# Altium project PCB_CLOCK_STM.PrjPcb
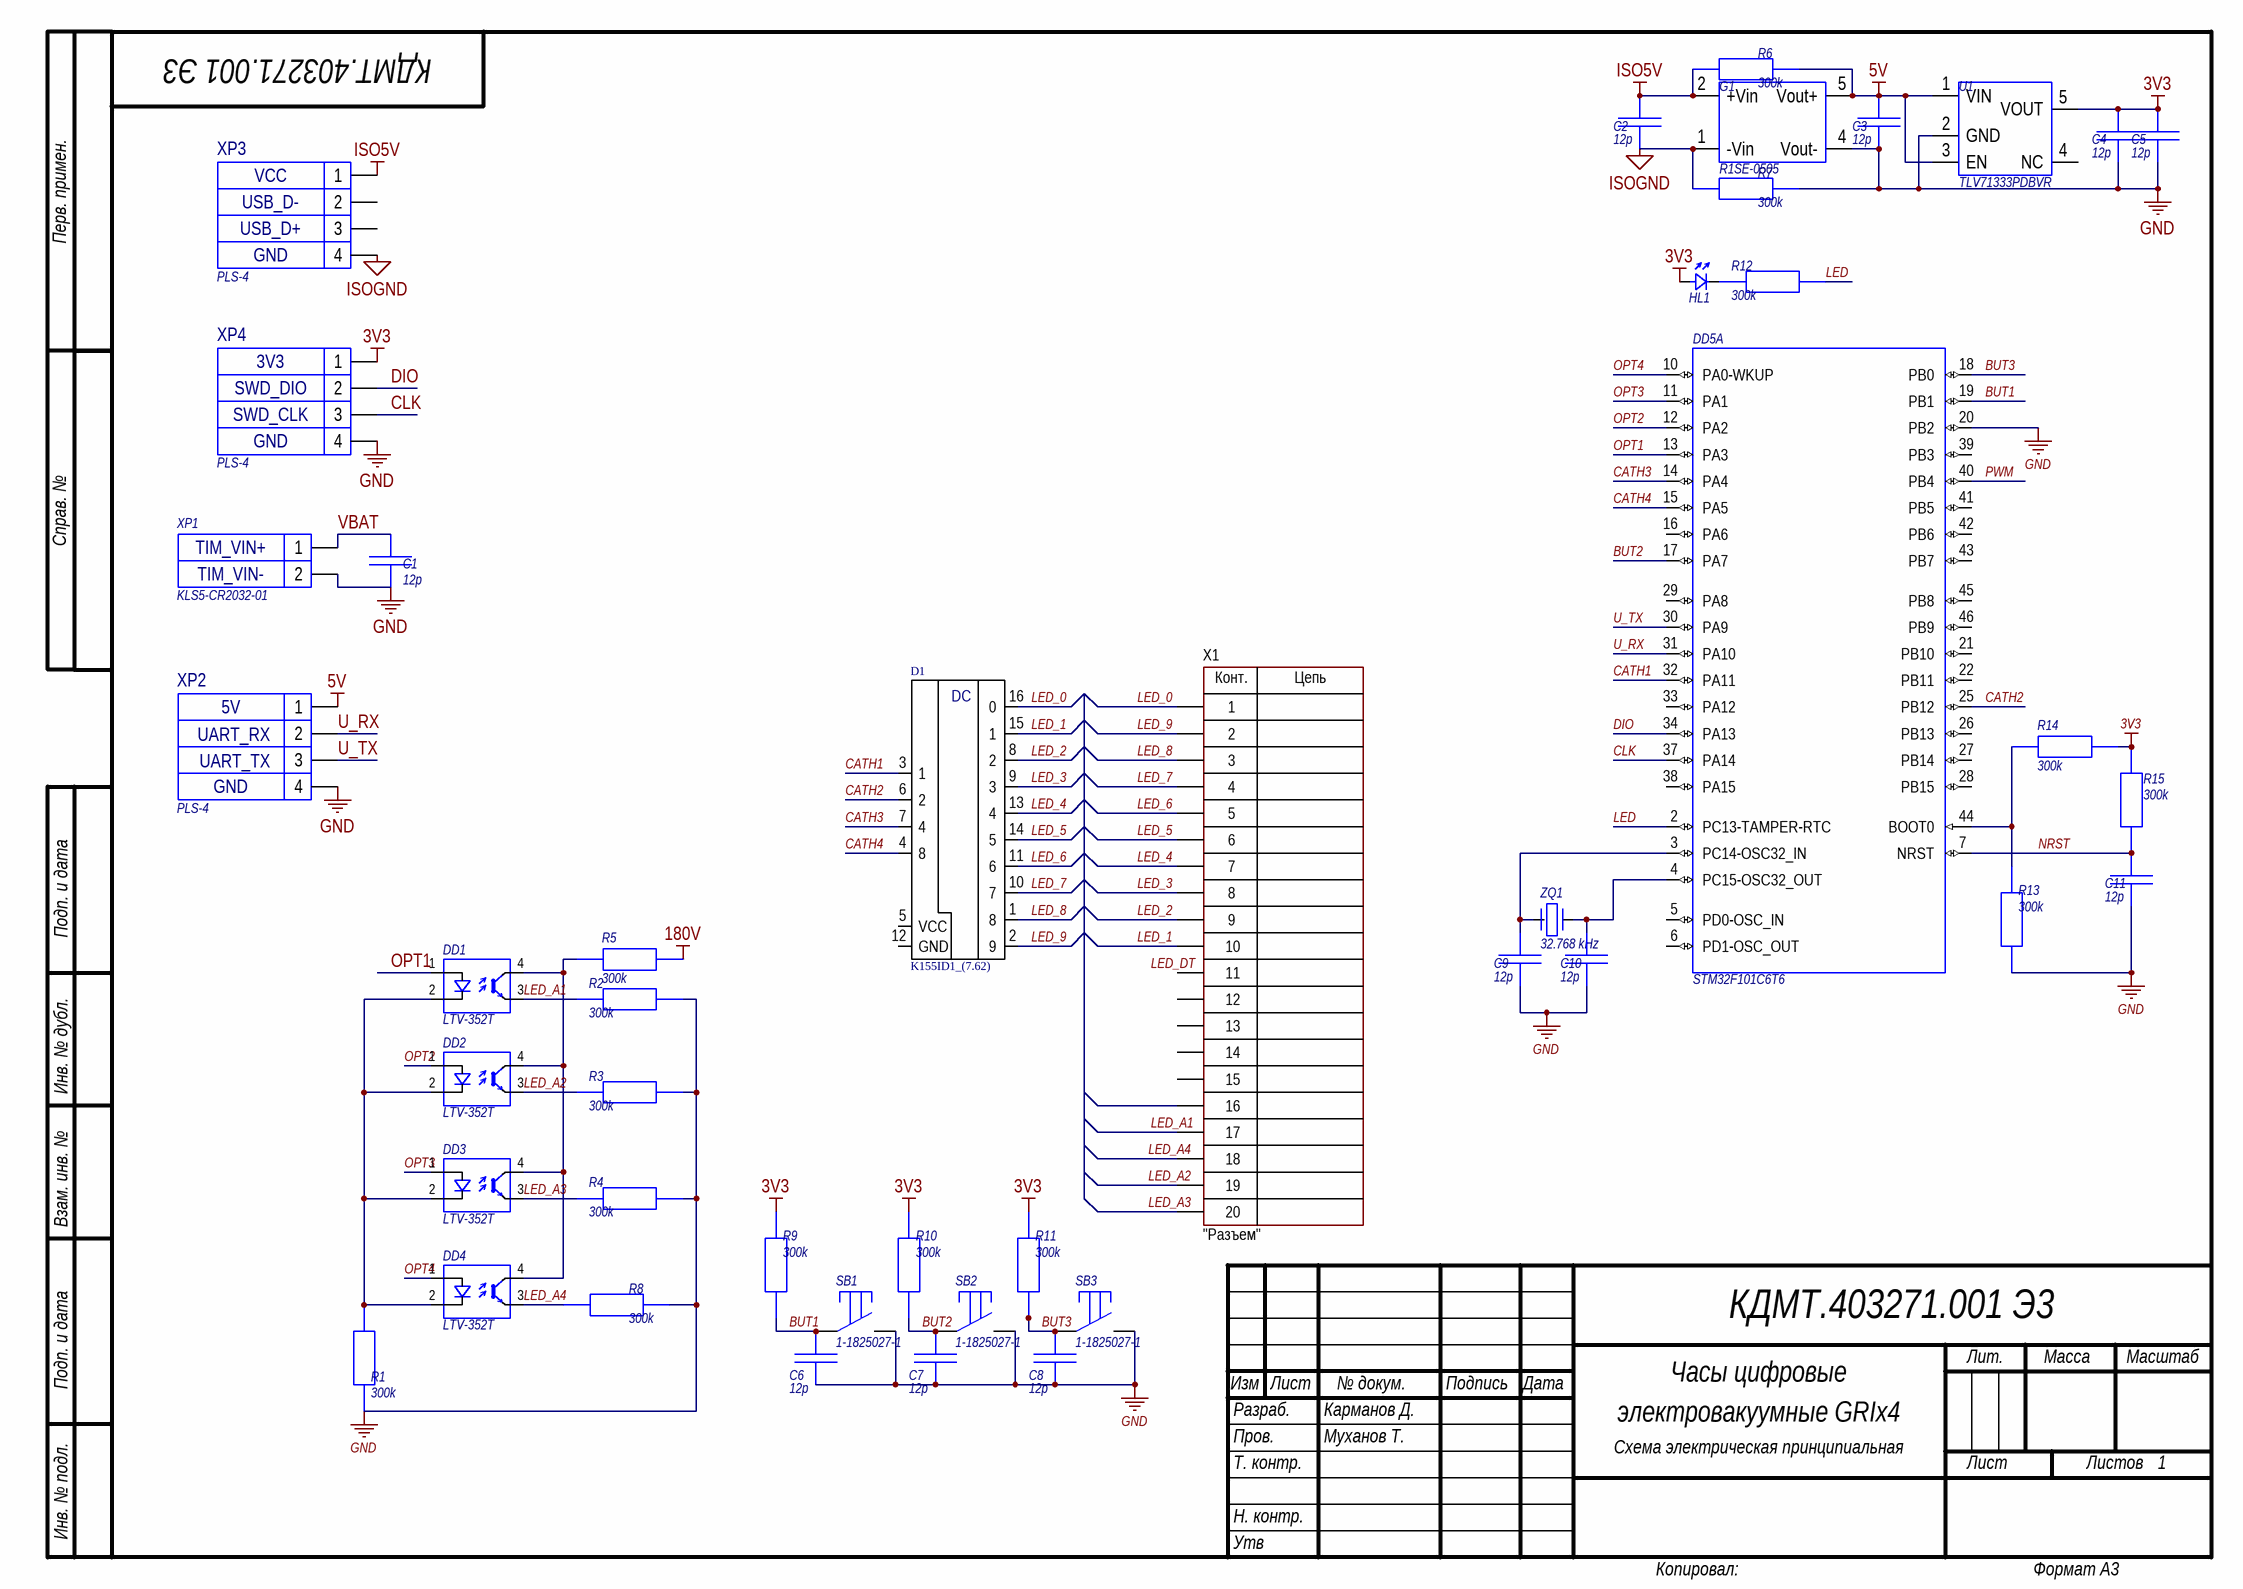
[diagram p0: Sheet1.SchDoc]
3 sheets, 61 parts. Net scope: global (net labels, ports and power ports of the same name join across sheets).
Board file: PCB1.PcbDoc
Sheets:
  Sheet1.SchDoc
  Sheet2.SchDoc
  Sheet3.SchDoc

## Sheet Sheet1.SchDoc
size 420 x 297 mm; 1_Listov: 1; 1_Naimenovanie1: Часы цифровые; 1_Naimenovanie2: электровакуумные GRIx4; 1_Naimenovanie3: Схема электрическая принципиальная; 1_Oboznachenie: КДМТ.403271.001 Э3; 1_T1Razrabotal: Карманов Д.; 1_T2Proveril: Муханов Т.; PageSetup: Record=PageOptions|CenterHorizontal=True|CenterVertical=True|PrintScale=0.98|XCorrection=1.00|YCorrection=1.00|PrintKind=1|BorderSize=5000000|LeftOffset=0|BottomOffset=0|Orientation=2|PaperLength=1000|PaperWidth=1000|Scale=100|PaperSource=7|PrintQuality=-3|MediaType=1|DitherType=10|PrintScaleMode=1|PaperKind=A3|PaperIndex=8

### Parts
C1  12p  [CAPACITOR 0603]
C2  12p  [CAPACITOR 0805]
C3  12p  [CAPACITOR 0603]
C4  12p  [CAPACITOR 0603]
C5  12p  [CAPACITOR 0603]
C6  12p  [CAPACITOR 0603]
C7  12p  [CAPACITOR 0603]
C8  12p  [CAPACITOR 0603]
C9  12p  [CAPACITOR 0603]
C10  12p  [CAPACITOR 0603]
C11  12p  [CAPACITOR 0603]
D1  K155ID1_(7.62)  [DIP-16_(7.62)]
DD1  LTV-352T  [SOP-4W]
DD2  LTV-352T  [SOP-4W]
DD3  LTV-352T  [SOP-4W]
DD4  LTV-352T  [SOP-4W]
DD5  STM32F101C6T6  [48-LQFP]  (part A of 2)
G1  R1SE-0505  [R1SE-0505]
HL1  LED  [LED 0603]  (value not drawn)
R1  300k  [RESISTOR 0603]
R2  300k  [RESISTOR 0603]
R3  300k  [RESISTOR 0603]
R4  300k  [RESISTOR 0603]
R5  300k  [RESISTOR 0603]
R6  300k  [RESISTOR 1206]
R7  300k  [RESISTOR 1206]
R8  300k  [RESISTOR 0603]
R9  300k  [RESISTOR 0603]
R10  300k  [RESISTOR 0603]
R11  300k  [RESISTOR 0603]
R12  300k  [RESISTOR 0805]
R13  300k  [RESISTOR 0603]
R14  300k  [RESISTOR 0603]
R15  300k  [RESISTOR 0603]
SB1  1-1825027-1  [BUTTON-R]
SB2  1-1825027-1  [BUTTON-R]
SB3  1-1825027-1  [BUTTON-R]
U1  TLV71333PDBVR  [SOT23-5]
X1  CommentText: "Разъем"  [CON: PBD-20]
XP1  KLS5-CR2032-01  [CR2032]
XP2  PLS-4  [PLS-4]
XP3  PLS-4  [PLS-4]
XP4  PLS-4  [PLS-4]
ZQ1  32.768 kHz  [SMD08038C4]

### Nets
3V3: C4.2 C5.2 HL1.2(A) R9.1 R10.1 R11.1 R14.2 R15.2 U1.5(VOUT) XP4.1
5V: C3.2 G1.5(Vout+) R6.1 U1.1(VIN) U1.3(EN) XP2.1
180V: R5.1
GND: C1.1 C3.1 C4.1 C5.1 C6.1 C7.1 C8.1 C9.1 C10.1 C11.1 DD5.20(PB2) G1.4(Vout-) R1.1 R2.2 R3.2 R4.2 R7.1 R8.1 R13.2 SB1.2 SB2.2 SB3.2 U1.2(GND) XP1.2 XP2.4 XP4.4
ISO5V: C2.2 G1.2(+Vin) R6.2 XP3.1
ISOGND: C2.1 G1.1(-Vin) R7.2 XP3.4
BUT1: C6.2 DD5.19(PB1) R9.2 SB1.1
BUT2: C7.2 DD5.17(PA7) R10.2 SB2.1
BUT3: C8.2 DD5.18(PB0) R11.2 SB3.1
CATH1: D1.3(1) DD5.32(PA11)
CATH2: D1.6(2) DD5.25(PB12)
CATH3: D1.7(4) DD5.14(PA4)
CATH4: D1.4(8) DD5.15(PA5)
CLK: DD5.37(PA14) XP4.3
DIO: DD5.34(PA13) XP4.2
LED: DD5.2(PC13-TAMPER-RTC) R12.2
LED_0: D1.16(0) X1.1
LED_1: D1.15(1) X1.10
LED_2: D1.8(2) X1.9
LED_3: D1.9(3) X1.8
LED_4: D1.13(4) X1.7
LED_5: D1.14(5) X1.6
LED_6: D1.11(6) X1.5
LED_7: D1.10(7) X1.4
LED_8: D1.1(8) X1.3
LED_9: D1.2(9) X1.2
LED_A1: DD1.3(PD1C) R2.1 X1.17
LED_A2: DD2.3(PD1C) R3.1 X1.19
LED_A3: DD3.3(PD1C) R4.1 X1.20
LED_A4: DD4.3(PD1C) R8.2 X1.18
NRST: C11.2 DD5.7(NRST) R15.1
OPT1: DD1.1(LED-) DD5.13(PA3)
OPT2: DD2.1(LED-) DD5.12(PA2)
OPT3: DD3.1(LED-) DD5.11(PA1)
OPT4: DD4.1(LED-) DD5.10(PA0-WKUP)
PWM: DD5.40(PB4)
U_RX: DD5.31(PA10) XP2.2
U_TX: DD5.30(PA9) XP2.3
VBAT: C1.2 XP1.1
NetC9_2: C9.2 DD5.3(PC14-OSC32_IN) ZQ1.1
NetC10_2: C10.2 DD5.4(PC15-OSC32_OUT) ZQ1.4
NetDD1_2: DD1.2(LED+) DD2.2(LED+) DD3.2(LED+) DD4.2(LED+) R1.2
NetDD1_4: DD1.4(PD1A) DD2.4(PD1A) DD3.4(PD1A) DD4.4(PD1A) R5.2
NetDD5_44: DD5.44(BOOT0) R13.1 R14.1
NetHL1_1: HL1.1(K) R12.1

Not connected (* = marked no-connect by the designer): D1 5(VCC) 12(GND); DD5 5(PD0-OSC_IN) 6(PD1-OSC_OUT) 16(PA6) 21(PB10) 22(PB11) 26(PB13) 27(PB14) 28(PB15) 29(PA8) 33(PA12) 38(PA15) 39(PB3) 41(PB5) 42(PB6) 43(PB7) 45(PB8) 46(PB9); U1 4(NC); X1 11 12 13 14 15 16; XP3 2 3

### Notes on the sheet
- VCC
- (near XP3) USB_D+
- (near XP3) USB_D-
- GND
- (near XP4) SWD_DIO
- 3V3
- (near XP4) SWD_CLK
- (near XP1) TIM_VIN+
- (near XP1) TIM_VIN-
- 5V
- (near XP2) UART_TX
- (near XP2) UART_RX
- Labels drawn without touching a wire or pin: LED_DT
- Перв. примен.
- Справ. №
- Подп. и дата
- Инв. № дубл.
- Взам. инв. №
- Изм
- Лист
- № докум.
- Подпись
- Дата
- Лит.
- Масса
- Масштаб
- Разраб.
- Пров.
- Т. контр.
- Листов
- Инв. № подл.
- Н. контр.
- Утв
- Копировал:
- Формат А3
- (in symbol K155ID1_(7.62)) DC
- (in symbol PBD-20) Конт.; Цепь

### Library data of the parts
C1-C11 = SMD-CAP: Capacitor
DD1-DD4 = ACPL-217-500E: Isolator
DD5 = STM32F103C8T6: Controller
G1 = R1SE-0505: POWER
R1-R15 = SMD-RES_1: Resistor
SB1-SB3 = SWITCH: Button
U1 = TPS76333DBVR: POWER
X1 = PBD-20: Manufacturer: Connfly; ValueManufacturerPartNumber: Connector, 20pin, 2.54mm, 500VAC, 3A; PartNumber: PLD-20; TypeConnector: Connector; VoltageMax: 500VAC; Pitch: 2.54mm; CurrentMax: 3A; Multichannel: 20pin; HelpURL: https://www.chipdip.ru/product/pld-20
XP1 = XP2: Connector
XP2-XP4 = XP4: Connector
ZQ1 = Quartz-ALARM: Quartz

## Sheet Sheet2.SchDoc
size 420 x 297 mm
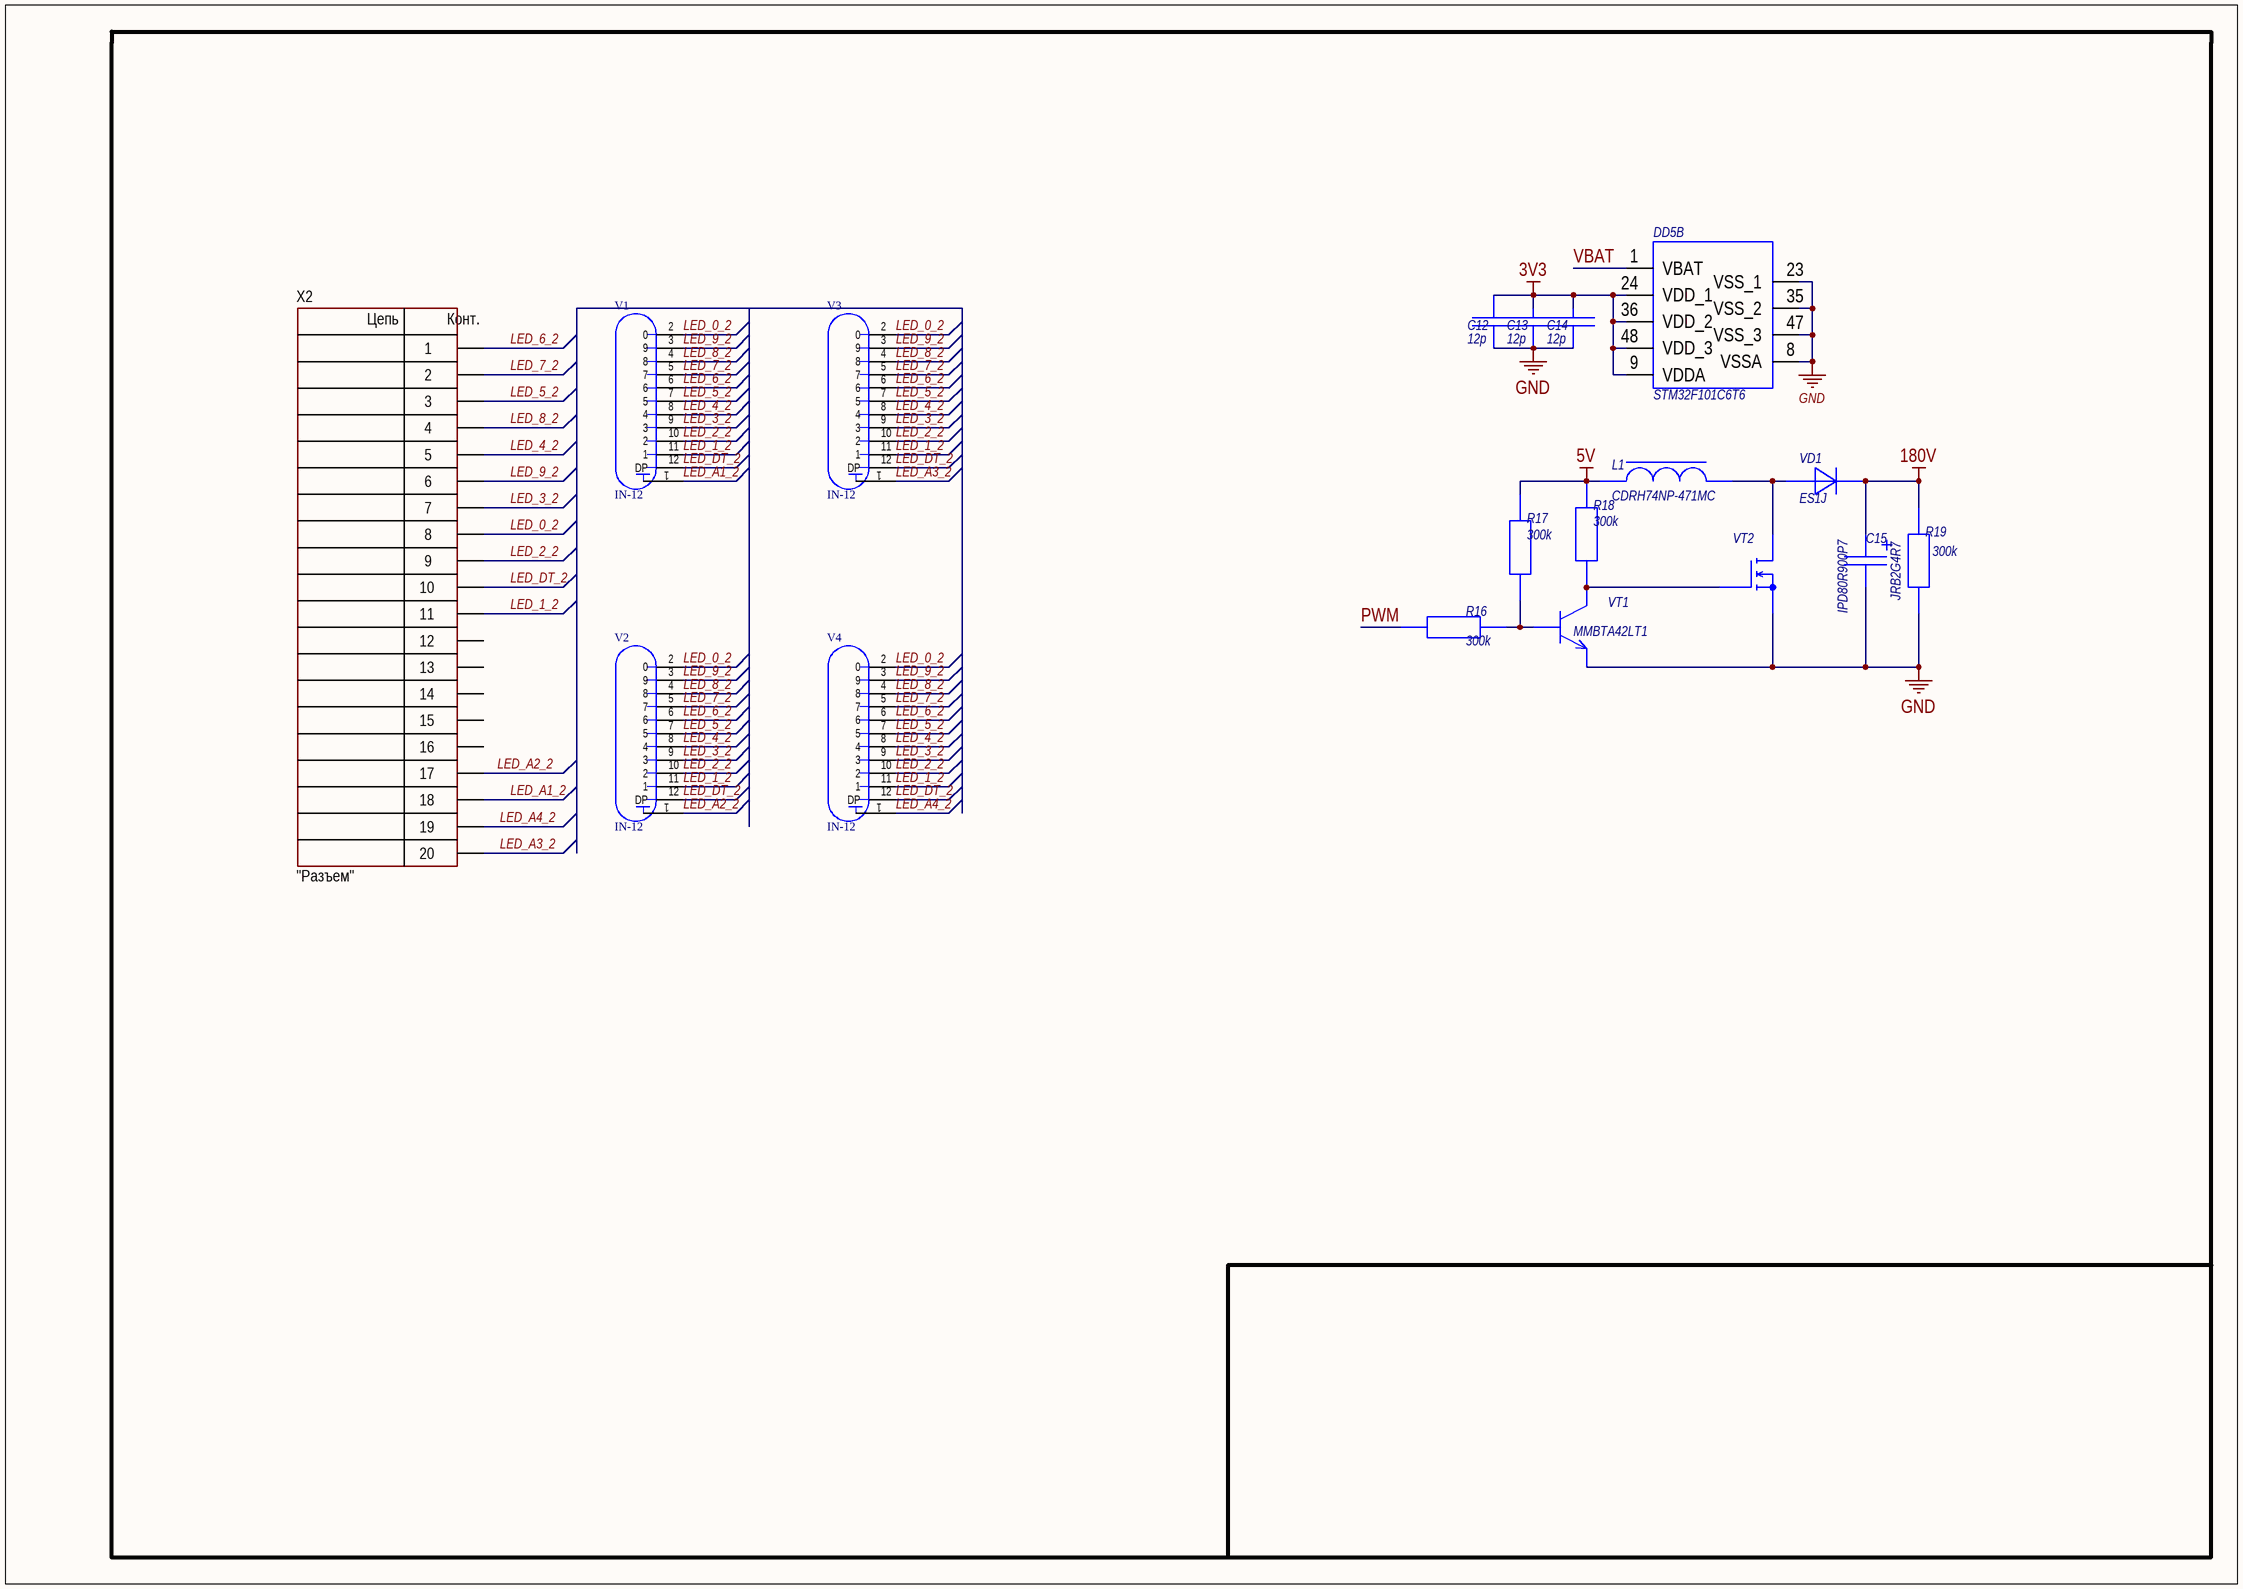
[diagram p1: Sheet2.SchDoc]

### Parts
C12  12p  [CAPACITOR 0603]
C13  12p  [CAPACITOR 0603]
C14  12p  [CAPACITOR 0603]
C15  JRB2G4R7  [CAPASITOR R10]
DD5  STM32F101C6T6  [48-LQFP]  (part B of 2)
L1  CDRH74NP-471MC  [SRR0603B]
R16  300k  [RESISTOR 0603]
R17  300k  [RESISTOR 0603]
R18  300k  [RESISTOR 0603]
R19  300k  [RESISTOR 0805]
V1  IN-12  [DIODE: IN-12]
V2  IN-12  [DIODE: IN-12]
V3  IN-12  [DIODE: IN-12]
V4  IN-12  [DIODE: IN-12]
VD1  ES1J  [DO-214]
VT1  MMBTA42LT1  [SOT-23]
VT2  IPD80R900P7  [DPAK]
X2  CommentText: "Разъем"  [CON: PLD-20-rebro]

### Nets
3V3: C12.2 C13.2 C14.2 DD5.9(VDDA) DD5.24(VDD_1) DD5.36(VDD_2) DD5.48(VDD_3)
5V: L1.1 R17.1 R18.1
180V: C15.1 R19.1 VD1.1(А)
GND: C12.1 C13.1 C14.1 C15.2 DD5.8(VSSA) DD5.23(VSS_1) DD5.35(VSS_2) DD5.47(VSS_3) R19.2 VT1.3(Э) VT2.3(S)
LED_0_2: V1.2(0) V2.2(0) V3.2(0) V4.2(0) X2.8
LED_1_2: V1.11(1) V2.11(1) V3.11(1) V4.11(1) X2.11
LED_2_2: V1.10(2) V2.10(2) V3.10(2) V4.10(2) X2.9
LED_3_2: V1.9(3) V2.9(3) V3.9(3) V4.9(3) X2.7
LED_4_2: V1.8(4) V2.8(4) V3.8(4) V4.8(4) X2.5
LED_5_2: V1.7(5) V2.7(5) V3.7(5) V4.7(5) X2.3
LED_6_2: V1.6 V2.6 V3.6 V4.6 X2.1
LED_7_2: V1.5(7) V2.5(7) V3.5(7) V4.5(7) X2.2
LED_8_2: V1.4(8) V2.4(8) V3.4(8) V4.4(8) X2.4
LED_9_2: V1.3(9) V2.3(9) V3.3(9) V4.3(9) X2.6
LED_A1_2: V1.1(A) X2.18
LED_A2_2: V2.1(A) X2.17
LED_A3_2: V3.1(A) X2.20
LED_A4_2: V4.1(A) X2.19
LED_DT_2: V1.12(DP) V2.12(DP) V3.12(DP) V4.12(DP) X2.10
PWM: R16.2
VBAT: DD5.1(VBAT)
NetL1_2: L1.2 VD1.2(К) VT2.2(D)
NetR16_1: R16.1 R17.2 VT1.1(Б)
NetR18_2: R18.2 VT1.2(К) VT2.1(G)

Not connected (* = marked no-connect by the designer): X2 12 13 14 15 16

### Notes on the sheet
- (in symbol PLD-20-REBRO) Цепь; Конт.

### Library data of the parts
C12-C14 = SMD-CAP: Capacitor
C15 = TC-D: Value: {Value}
DD5 = STM32F103C8T6: Controller
L1 = Inductor
R16-R19 = SMD-RES_1: Resistor
V1-V4 = IN-12: Vacuum Indicator; Published: 8-Jun-2000; LatestRevisionDate: 17-Jul-2002; LatestRevisionNote: Re-released for DXP Platform.; PackageReference: VTUBE-9; Publisher: Altium Limited; PackageDescription: Vacuum Tube; 9 Leads
VD1 = D-Diod: Diod
VT1 = Transistor-NPN: Transistor; Обозначение для заказа: IRLML2502TRPBF
VT2 = Channel-N: Transistor; Обозначение для заказа: IRLML2502TRPBF
X2 = PLD-20-REBRO: Manufacturer: Connfly; ValueManufacturerPartNumber: Connector, 20pin, 2.54mm, 500VAC, 3A; PartNumber: PLD-20; TypeConnector: Connector; VoltageMax: 500VAC; Pitch: 2.54mm; CurrentMax: 3A; Multichannel: 20pin; HelpURL: https://www.chipdip.ru/product/pld-20

## Sheet Sheet3.SchDoc
size 420 x 297 mm
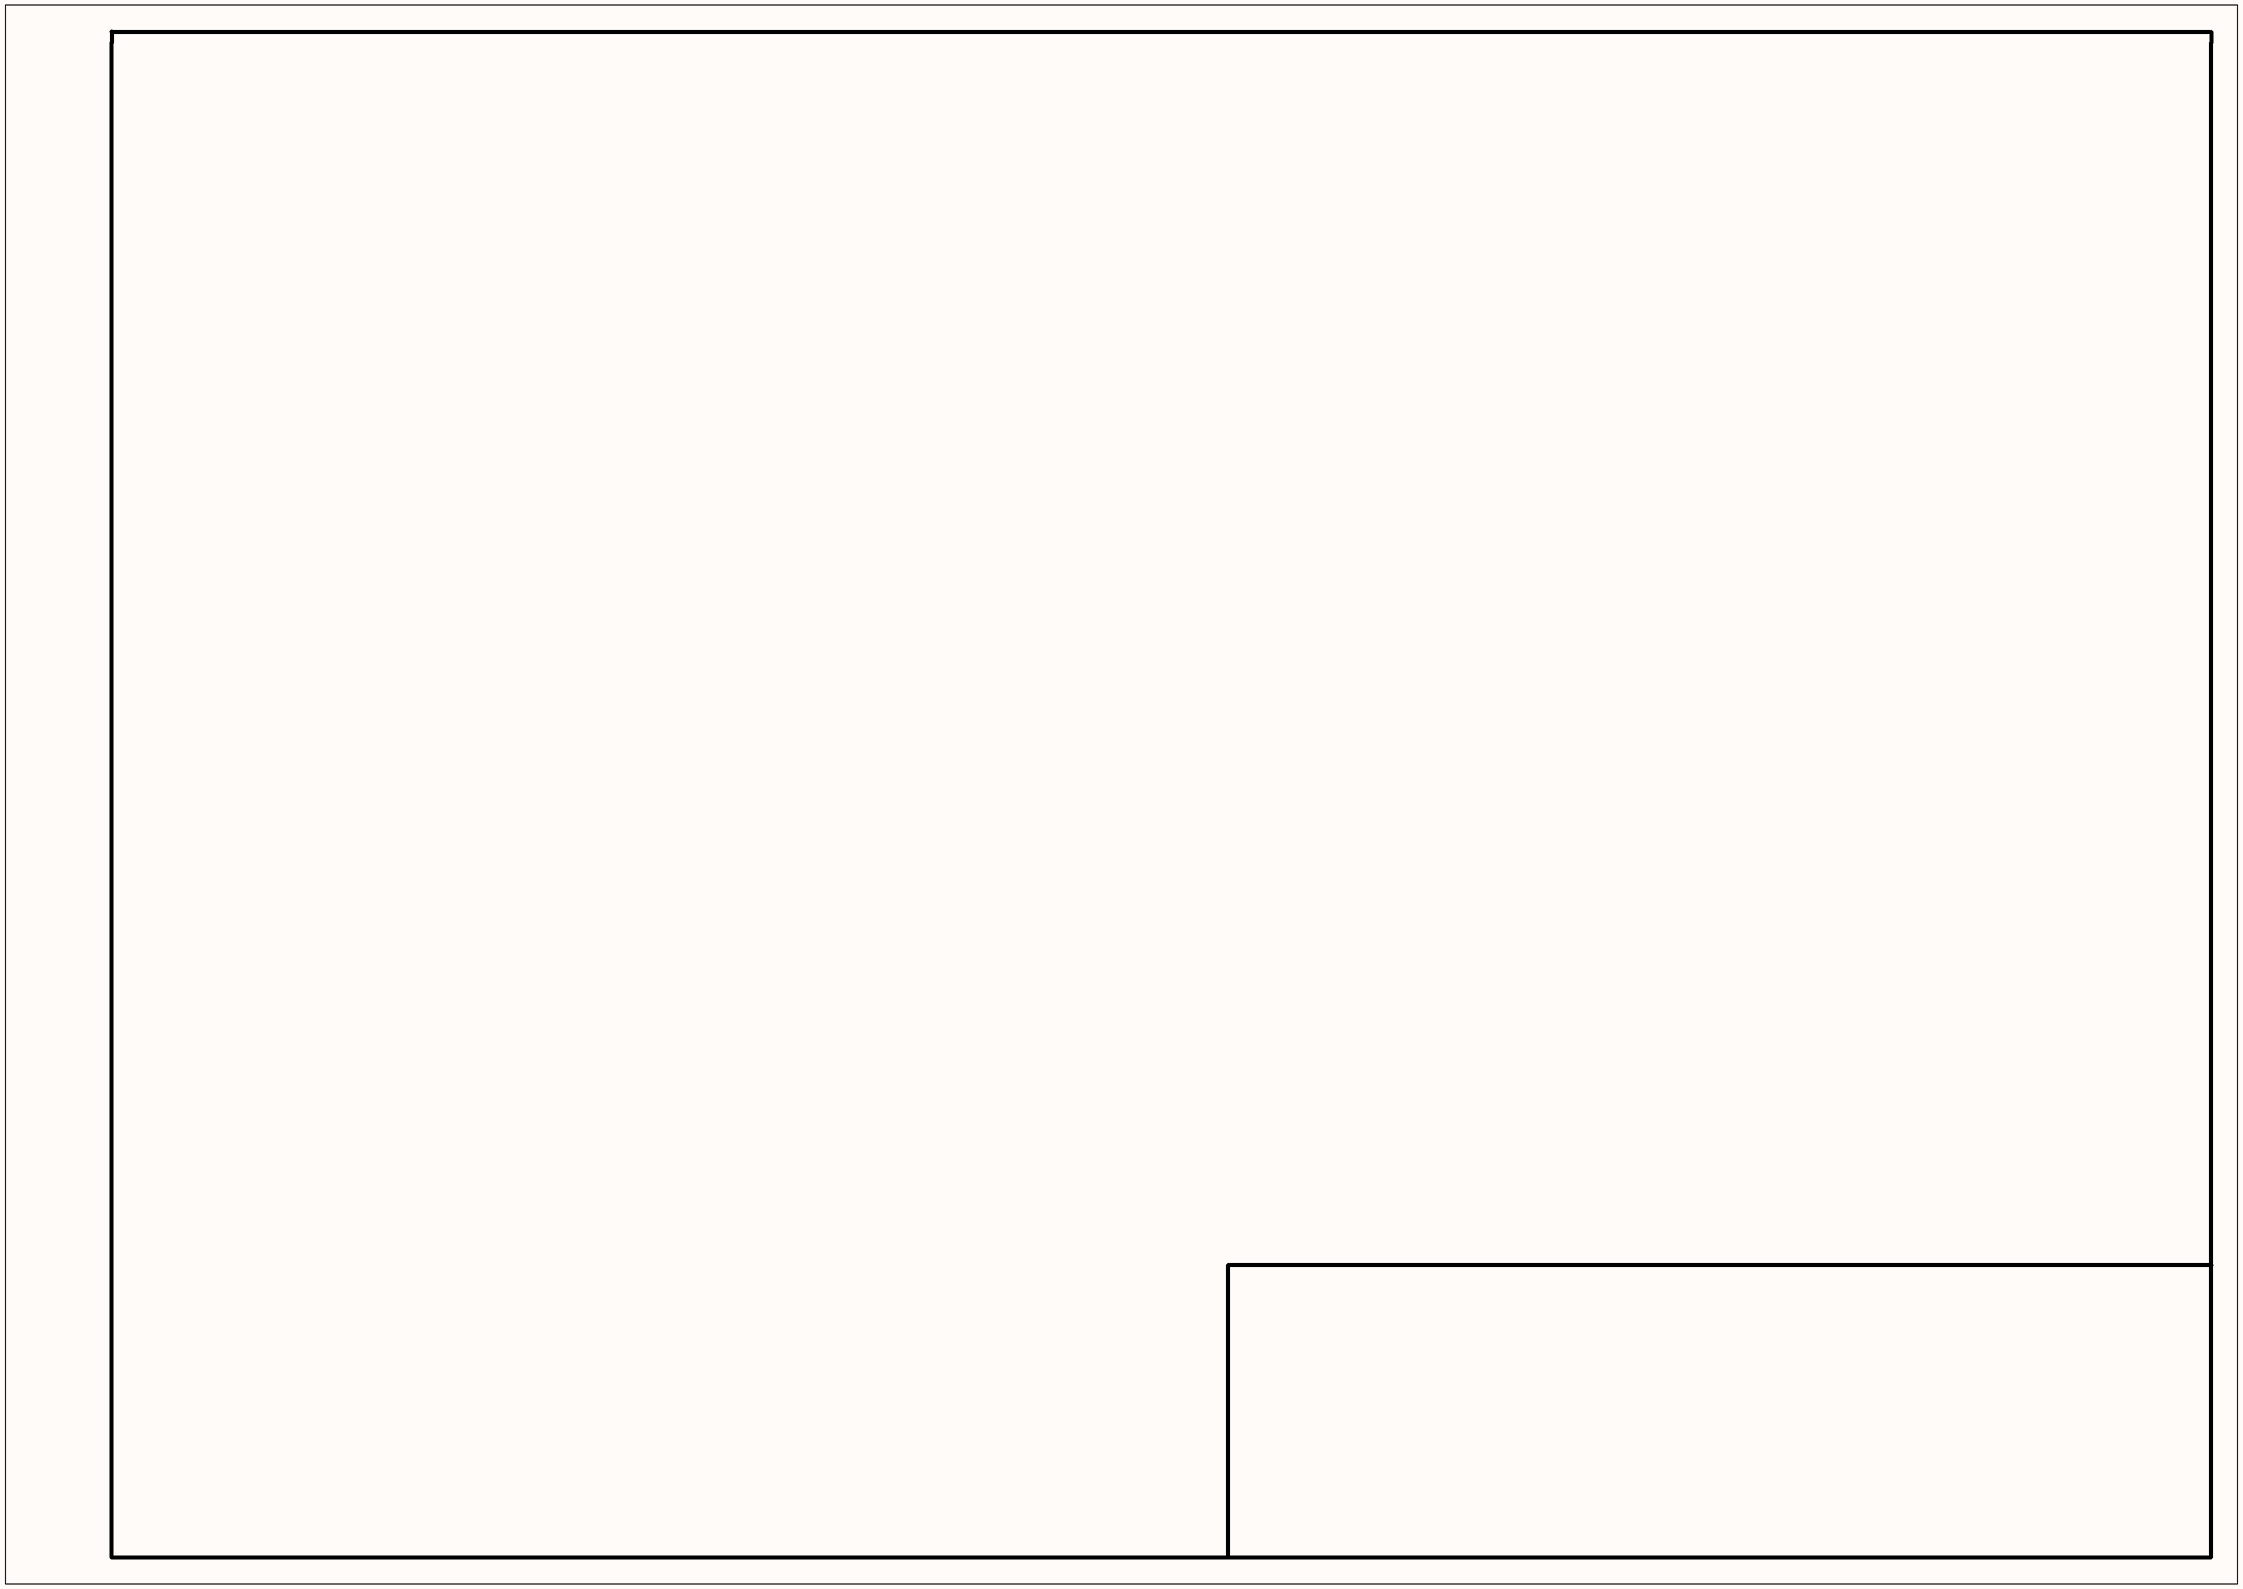
[diagram p2: Sheet3.SchDoc]

## Nets that join several sheets
3V3: Sheet1 (10 pins), Sheet2 (7 pins)
5V: Sheet1 (6 pins), Sheet2 (L1.1 R17.1 R18.1)
180V: Sheet1 (R5.1), Sheet2 (C15.1 R19.1 VD1.1)
GND: Sheet1 (26 pins), Sheet2 (11 pins)
PWM: Sheet1 (DD5.40), Sheet2 (R16.2)
VBAT: Sheet1 (C1.2 XP1.1), Sheet2 (DD5.1)